# Altium project HV_BMS.PrjPcb (part 1 of 2)
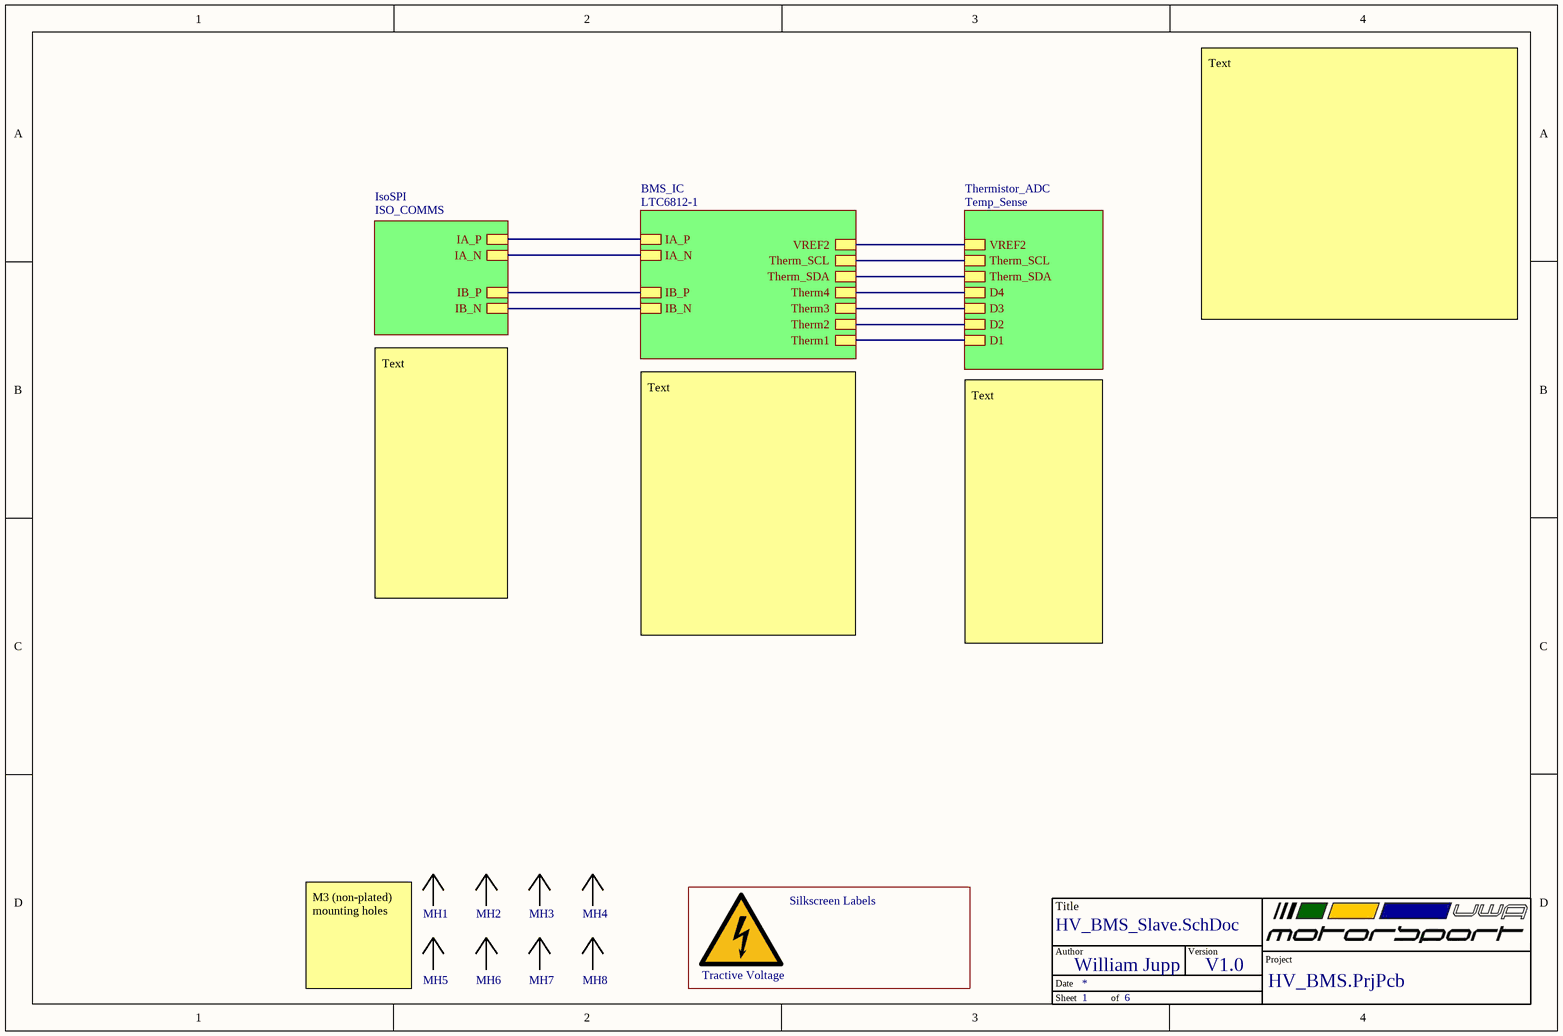
[diagram p0: HV_BMS_Slave.SchDoc]
Version: V1.0; ProAuthor: William Jupp
6 sheets, 304 parts. Net scope: hierarchical (ports join the sheet entries above them; power ports are global).
Board file: Slave_LHS.PcbDoc
Sheets:
  HV_BMS_Slave.SchDoc
    BMS_IC = LTC6812-1.SchDoc
      BC1 = Balance_Circuit.SchDoc
      BC2 = Balance_Circuit.SchDoc
      BC3 = Balance_Circuit.SchDoc
      BC4 = Balance_Circuit.SchDoc
      BC5 = Balance_Circuit.SchDoc
      BC6 = Balance_Circuit.SchDoc
      BC7 = Balance_Circuit.SchDoc
      BC8 = Balance_Circuit.SchDoc
      BC9 = Balance_Circuit.SchDoc
      BC10 = Balance_Circuit.SchDoc
      BC11 = Balance_Circuit.SchDoc
      BC12 = Balance_Circuit.SchDoc
      BC13 = Balance_Circuit.SchDoc
      BC14 = Balance_Circuit.SchDoc
    IsoSPI = ISO_COMMS.SchDoc
    Thermistor_ADC = Temp_Sense.SchDoc
      AFE1 = AFE.SchDoc
      AFE2 = AFE.SchDoc
      AFE3 = AFE.SchDoc
      AFE4 = AFE.SchDoc
      AFE5 = AFE.SchDoc
      AFE6 = AFE.SchDoc
      AFE7 = AFE.SchDoc
      AFE8 = AFE.SchDoc
      AFE9 = AFE.SchDoc
      AFE10 = AFE.SchDoc
      AFE11 = AFE.SchDoc
      AFE12 = AFE.SchDoc
      AFE13 = AFE.SchDoc
      AFE14 = AFE.SchDoc
      AFE15 = AFE.SchDoc
      AFE16 = AFE.SchDoc
      AFE17 = AFE.SchDoc
      AFE18 = AFE.SchDoc
      AFE19 = AFE.SchDoc
      AFE20 = AFE.SchDoc
      AFE21 = AFE.SchDoc
      AFE22 = AFE.SchDoc
      AFE23 = AFE.SchDoc
      AFE24 = AFE.SchDoc
      AFE25 = AFE.SchDoc
      AFE26 = AFE.SchDoc
      AFE27 = AFE.SchDoc
      AFE28 = AFE.SchDoc

## Sheet HV_BMS_Slave.SchDoc: HV_BMS_Slave1
size A4; Revision: V1.0; SheetNumber: 1; SheetTotal: 6

### Parts
(Parts that share a designator on the sheet are numbered #1, #2 ... from top to bottom, then left to right.)
1  UWAM Logo  [UWAM Logo]  (value not drawn)
*#1  TitleBlock  (value not drawn)  (graphical)
?  Tractive voltage symbol  [Tractive voltage]  (value not drawn)  (graphical)
MH1  M3 Mounting Holes  [M3 MH]  (value not drawn)  (mechanical)
MH2  M3 Mounting Holes  [M3 MH]  (value not drawn)  (mechanical)
MH3  M3 Mounting Holes  [M3 MH]  (value not drawn)  (mechanical)
MH4  M3 Mounting Holes  [M3 MH]  (value not drawn)  (mechanical)
MH5  M3 Mounting Holes  [M3 MH]  (value not drawn)  (mechanical)
MH6  M3 Mounting Holes  [M3 MH]  (value not drawn)  (mechanical)
MH7  M3 Mounting Holes  [M3 MH]  (value not drawn)  (mechanical)
MH8  M3 Mounting Holes  [M3 MH]  (value not drawn)  (mechanical)

### Blocks framed on the sheet
Silkscreen Labels: 1 ?

### Sub-sheets
BMS_IC = LTC6812-1: IA_N, IA_P, IB_N, IB_P, Therm2, Therm3, Therm4, Therm1, Therm_SCL, Therm_SDA, VREF2
IsoSPI = ISO_COMMS: IA_N, IA_P, IB_N, IB_P
Thermistor_ADC = Temp_Sense: Therm_SDA, Therm_SCL, D4, D3, D1, D2, VREF2

### Nets
IA_N: sheet BMS_IC/IA_N, sheet IsoSPI/IA_N
IA_P: sheet BMS_IC/IA_P, sheet IsoSPI/IA_P
IB_N: sheet BMS_IC/IB_N, sheet IsoSPI/IB_N
IB_P: sheet BMS_IC/IB_P, sheet IsoSPI/IB_P
SCL: sheet BMS_IC/Therm_SCL, sheet Thermistor_ADC/Therm_SCL
SDA: sheet BMS_IC/Therm_SDA, sheet Thermistor_ADC/Therm_SDA
VREF2: sheet BMS_IC/VREF2, sheet Thermistor_ADC/VREF2
NetU1_8: sheet BMS_IC/Therm4, sheet Thermistor_ADC/D4
NetU2_8: sheet BMS_IC/Therm3, sheet Thermistor_ADC/D3
NetU3_8: sheet BMS_IC/Therm2, sheet Thermistor_ADC/D2
NetU4_8: sheet BMS_IC/Therm1, sheet Thermistor_ADC/D1

### Notes on the sheet
- Text
- M3 (non-plated) mounting holes
- (in symbol TitleBlock) Title; Author; Version; Project; Date; Sheet; of
- (in symbol Tractive voltage symbol) Tractive Voltage

## Sheet LTC6812-1.SchDoc
size A4; SheetNumber: 4; SheetTotal: 6
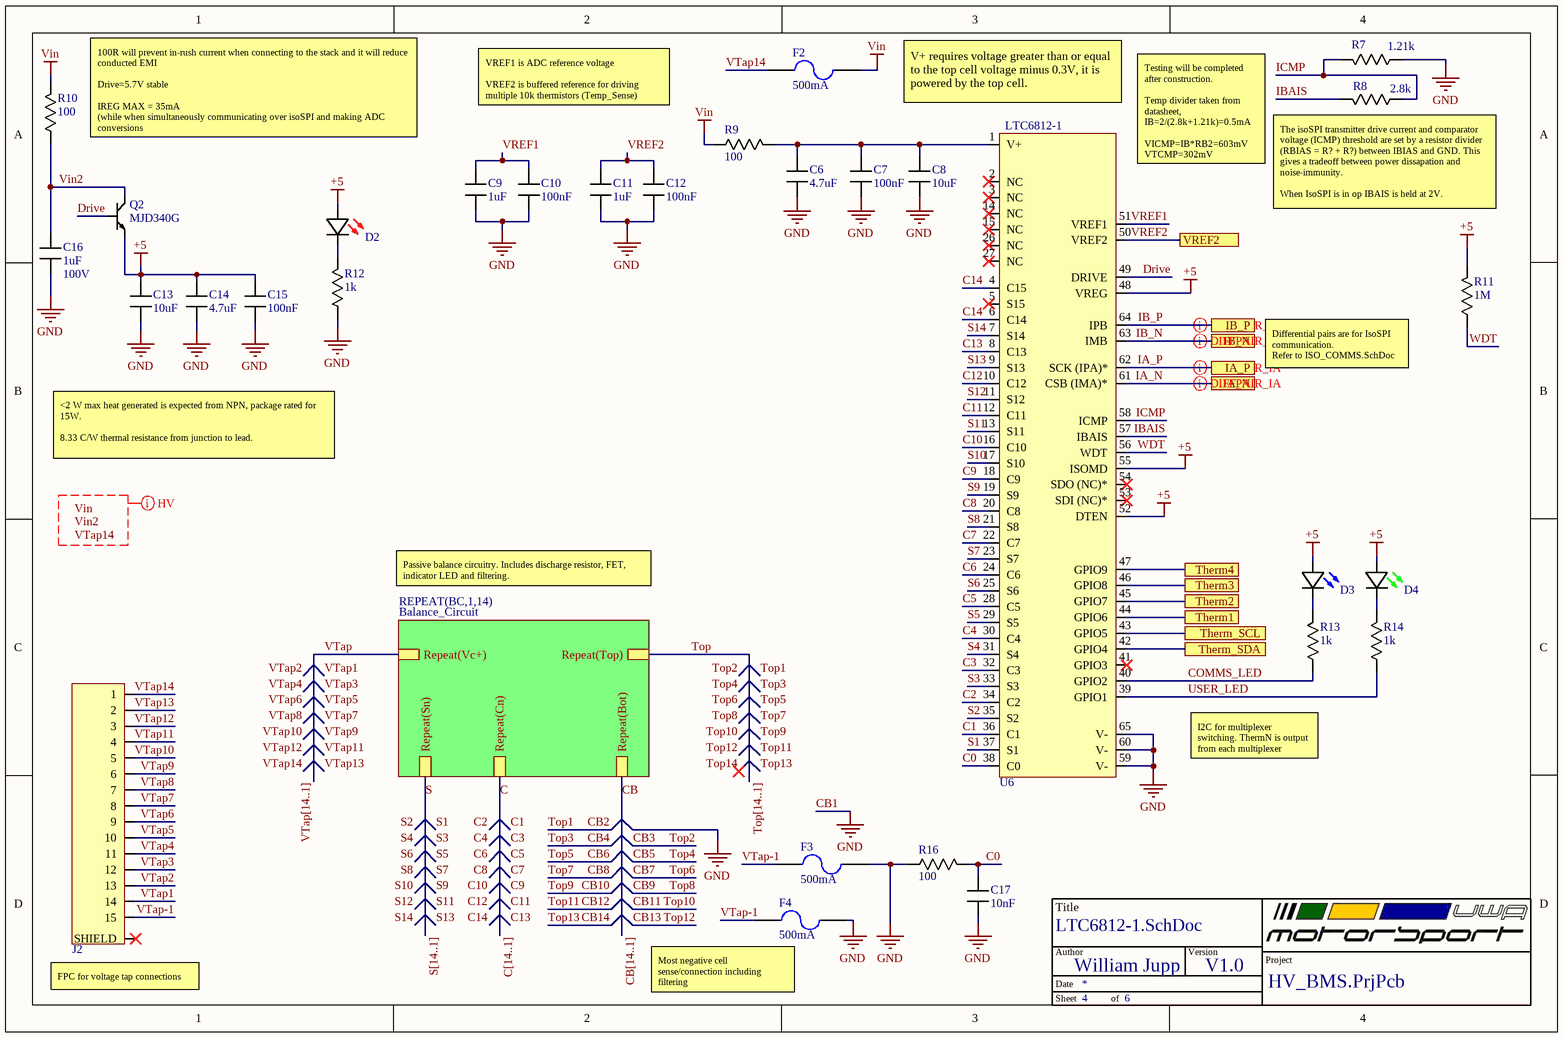
[diagram p1: LTC6812-1.SchDoc]

### Parts
(Parts that share a designator on the sheet are numbered #1, #2 ... from top to bottom, then left to right.)
*#2  TitleBlock  (value not drawn)  (graphical)
C6  value 4.7uF  [C_0603]  (hidden comment: C)
C7  value 100nF  [C_0603]  (hidden comment: C)
C8  value 10uF  [C_0603]  (hidden comment: C)
C9  value 1uF  [C_0603]  (hidden comment: C)
C10  value 100nF  [C_0603]  (hidden comment: C)
C11  value 1uF  [C_0603]  (hidden comment: C)
C12  value 100nF  [C_0603]  (hidden comment: C)
C13  value 10uF  [C_0603]  (hidden comment: C)
C14  value 4.7uF  [C_0603]  (hidden comment: C)
C15  value 100nF  [C_0603]  (hidden comment: C)
C16  value 1uF  Voltage: 100V  [C_0603]  (hidden comment: C)
C17  value 10nF  [C_0603]  (hidden comment: C)
D2  150060SS55040  [LED (0603)]  (value not drawn)
D3  150060BS55040  [LED (0603)]  (value not drawn)
D4  150060GS55040  [LED (0603)]  (value not drawn)
F2  Current Rating: 500mA  [0466.500NR]  (hidden comment: 0466.500NR)
F3  Current Rating: 500mA  [0466.500NR]  (hidden comment: 0466.500NR)
F4  Current Rating: 500mA  [0466.500NR]  (hidden comment: 0466.500NR)
J2  1-84953-5  [1-84953-5]  (value not drawn)
Q2  MJD340G  [TO-252-3]
R7  value 1.21k  [R-0603]  (hidden comment: Resistor)
R8  value 2.8k  [R-0603]  (hidden comment: RB1)
R9  value 100  [R_2010]  (hidden comment: ERJ-12ZYJ101U)
R10  value 100  [R_2010]  (hidden comment: ERJ-12ZYJ101U)
R11  value 1M  [R-0603]  (hidden comment: Resistor)
R12  value 1k  [R-0603]  (hidden comment: Resistor)
R13  value 1k  [R-0603]  (hidden comment: Resistor)
R14  value 1k  [R-0603]  (hidden comment: Resistor)
R16  value 100  [R-0603]  (hidden comment: Resistor)
U6  LTC6812-1  [64-eLQFP]

### Sub-sheets
REPEAT(BC,1,14) = Balance_Circuit: Repeat(Cn), Repeat(Sn), Repeat(Vc+), Repeat(Bot), Repeat(Top)

### Ports
IA_N, IA_P, IB_N, IB_P, Therm1, Therm2, Therm3, Therm4, Therm_SCL, Therm_SDA, VREF2

### Nets
+5: C13.2 C14.2 C15.2 D2.2(A) D3.2(A) D4.2(A) Q2.3(Emitter) R11.1 U6.48(VREG) U6.52(DTEN) U6.55(ISOMD)
CB1: C6.1 C7.1 C8.1 C9.1 C10.1 C11.1 C12.1 C13.1 C14.1 C15.1 C16.1 C17.1 F3.2 F4.2 R7.1 R12.1 R16.1 U6.59(V-) U6.60(V-) U6.65(V-)  [also labelled GND]
Vin: F2.2 R9.1 R10.2
C: sheet REPEAT(BC,1,14)/Repeat(Cn)
C0: C17.2 R16.2 U6.38(C0)
C1: U6.36(C1)
C2: U6.34(C2)
C3: U6.32(C3)
C4: U6.30(C4)
C5: U6.28(C5)
C6: U6.24(C6)
C7: U6.22(C7)
C8: U6.20(C8)
C9: U6.18(C9)
C10: U6.16(C10)
C11: U6.12(C11)
C12: U6.10(C12)
C13: U6.8(C13)
C14: U6.4(C15) U6.6(C14)
CB: sheet REPEAT(BC,1,14)/Repeat(Bot)
COMMS_LED: R13.1 U6.40(GPIO2)
Drive: Q2.1(Base) U6.49(DRIVE)
IA_N: U6.61(CSB_(IMA)*) ; port IA_N
IA_P: U6.62(SCK_(IPA)*) ; port IA_P
IB_N: U6.63(IMB) ; port IB_N
IB_P: U6.64(IPB) ; port IB_P
IBAIS: R8.2 U6.57(IBAIS)
ICMP: R7.2 R8.1 U6.58(ICMP)
S: sheet REPEAT(BC,1,14)/Repeat(Sn)
S1: U6.37(S1)
S2: U6.35(S2)
S3: U6.33(S3)
S4: U6.31(S4)
S5: U6.29(S5)
S6: U6.25(S6)
S7: U6.23(S7)
S8: U6.21(S8)
S9: U6.19(S9)
S10: U6.17(S10)
S11: U6.13(S11)
S12: U6.11(S12)
S13: U6.9(S13)
S14: U6.7(S14)
SCL: U6.43(GPIO5) ; port Therm_SCL
SDA: U6.42(GPIO4) ; port Therm_SDA
Top: sheet REPEAT(BC,1,14)/Repeat(Top)
USER_LED: R14.1 U6.39(GPIO1)
Vin2: C16.2 Q2.2(Collector) R10.1
VREF1: C9.2 C10.2 U6.51(VREF1)
VREF2: C11.2 C12.2 U6.50(VREF2) ; port VREF2
VTap: sheet REPEAT(BC,1,14)/Repeat(Vc+)
VTap1: J2.14
VTap2: J2.13
VTap3: J2.12
VTap4: J2.11
VTap5: J2.10
VTap6: J2.9
VTap7: J2.8
VTap8: J2.7
VTap9: J2.6
VTap10: J2.5
VTap11: J2.4
VTap12: J2.3
VTap13: J2.2
VTap14: F2.1 J2.1
VTap-1: F3.1 F4.1 J2.15
WDT: R11.2 U6.56(WDT)
NetC6_2: C6.2 C7.2 C8.2 R9.2 U6.1(V+)
NetD2_1: D2.1(K) R12.2
NetD3_1: D3.1(K) R13.2
NetD4_1: D4.1(K) R14.2
NetU1_8: U6.47(GPIO9) ; port Therm4
NetU2_8: U6.46(GPIO8) ; port Therm3
NetU3_8: U6.45(GPIO7) ; port Therm2
NetU4_8: U6.44(GPIO6) ; port Therm1

Not connected (* = marked no-connect by the designer): J2 S(SHIELD)*; U6 2(NC)* 3(NC)* 5(S15)* 14(NC)* 15(NC)* 26(NC)* 27(NC)* 41(GPIO3)* 53(SDI_(NC)*)* 54(SDO_(NC)*)*

### Buses and harness runs
bus C[14..1]
bus CB[14..1]
bus S[14..1]
bus Top[14..1]
bus VTap[14..1]

### Layout directives
differential pair; differential pair class IB: IB_N, IB_P
differential pair; differential pair class IA: IA_N, IA_P
net class HVNetClass: Vin, Vin2, VTap14

### Notes on the sheet
- VREF1 is ADC reference voltage
  VREF2 is buffered reference for driving multiple 10k thermistors (Temp_Sense)
- V+ requires voltage greater than or equal to the top cell voltage minus 0.3V, it is powered by the top cell.
- 100R will prevent in-rush current when connecting to the stack and it will reduce conducted EMI
  Drive=5.7V stable
  IREG MAX = 35mA
  (while when simultaneously communicating over isoSPI and making ADC conversions
- (near U6) Testing will be completed after construction.
  Temp divider taken from datasheet,
  IB=2/(2.8k+1.21k)=0.5mA
  VICMP=IB*RB2=603mV
  VTCMP=302mV
- (near R8) The isoSPI transmitter drive current and comparator
  voltage (ICMP) threshold are set by a resistor divider (RBIAS = R? + R?) between IBIAS and GND. This gives a tradeoff between power dissapation and noise-immunity.
  When IsoSPI is in op IBAIS is held at 2V.
  IP and IM current = 20*IB
- Differential pairs are for IsoSPI communication.
  Refer to ISO_COMMS.SchDoc
- <2 W max heat generated is expected from NPN, package rated for 15W.
  8.33 C/W thermal resistance from junction to lead.
- Passive balance circuitry. Includes discharge resistor, FET, indicator LED and filtering.
- I2C for multiplexer switching. ThermN is output from each multiplexer
- (near J2) FPC for voltage tap connections
- (near F4) Most negative cell sense/connection including filtering
- Labels drawn without touching a wire or pin: C1, C2, C3, C4, C5, C6, C7, C8, C9, C10, C11, C12, C13, C14, S1, S2, S3, S4, S5, S6, S7, S8, S9, S10, S11, S12, S13, S14, Top1, Top2, Top3, Top4, Top5, Top6, Top7, Top8, Top9, Top10, Top11, Top12, Top13, Top14, Vin, Vin2, VTap1, VTap2, VTap3, VTap4, VTap5, VTap6, VTap7, VTap8, VTap9, VTap10, VTap11, VTap12, VTap13, VTap14
- (in symbol TitleBlock) Title; Author; Version; Project; Date; Sheet; of

### Library data of the parts
C6-C8 C13-C17 = Capacitor: ComponentLink1Description: New link; ComponentLink1URL: *
C9-C12 = Capacitor: Bypass caps; ComponentLink1Description: New link; ComponentLink1URL: *
D2 = 150060SS55040: LED RED DIFFUSED 0603 SMD; Manufacturer: Wurth Electronics; Lens Style: Flat; Luminous Intensity: 70mcd; Forward Voltage: 2V; Test Current: 20mA; Viewing Angle: 140°; Dominant Wavelength: 630nm; Lens Size: 0.8mm; Supplier 1: Mouser; Manufacturer Part Number: 150060SS55040; RoHS: No; Category: LEDs; Stock 1: 17006; Pricing 1: 1=0.18000, 10=0.16800, 50=0.16800, 100=0.15200, 1000=0.12100, 10000=0.10600 (USD); Mount: Surface Mount; Case/Package: 0603; Color: Red; Case Code (Imperial): 0603; Case Code (Metric): 1608; Packaging: Tape and Reel; Lens Transparency: Diffused; Length: 1.6mm; Width: 0.8mm; Height: 0.5mm; RoHS Compliant: No; Supplier Part Number 1: 710-150060SS55040
D3 = 150060BS55040: LED BLUE DIFFUSED 0603 SMD; Manufacturer: Wurth Electronics; Lens Style: Flat; Luminous Intensity: 80mcd; Forward Voltage: 3.2V; Test Current: 20mA; Viewing Angle: 140°; Dominant Wavelength: 470nm; Lens Size: 0.8mm; Supplier 1: Mouser; Manufacturer Part Number: 150060BS55040; RoHS: No; Pricing 1: 1=0.18000, 10=0.16800, 50=0.16800, 100=0.15200, 1000=0.12100, 10000=0.10600 (USD); Mount: Surface Mount; Case/Package: 0603; Color: Blue; Packaging: Tape and Reel; Lens Transparency: Diffused; Length: 1.6mm; Width: 0.8mm; Height: 0.5mm; RoHS Compliant: No; ComponentLink1URL: http://www.farnell.com/datasheets/2621640.pdf?src-supplier=Farnell; ComponentLink1Description: http://www.farnell.com/datasheets/2621640.pdf?src-supplier=Farnell; ComponentLink2URL: https://www.we-online.de/web/en/index.php/download/media/07_electronic_components/download_center_1/application_notes_berichte/ano002_leds___the_future_of_horticultural_lighting/ANO002b_EN_LEDs_The_Future_of_Horticultural_Lighting.pdf?src-supplier=Digi-Key; ComponentLink2Description: https://www.we-online.de/web/en/index.php/download/media/07_electronic_components/download_center_1/application_notes_berichte/ano002_leds___the_future_of_horticultural_lighting/ANO002b_EN_LEDs_The_Future_of_Horticultural_Lighting.pdf?src-supplier=Digi-Key; ComponentLink3URL: https://katalog.we-online.de/pbs/datasheet/150060BS55040.pdf?src-supplier=Digi-Key; ComponentLink3Description: https://katalog.we-online.de/pbs/datasheet/150060BS55040.pdf?src-supplier=Digi-Key; ComponentLink4URL: http://www.farnell.com/datasheets/2621640.pdf?src-supplier=Newark; ComponentLink4Description: http://www.farnell.com/datasheets/2621640.pdf?src-supplier=Newark; Supplier Part Number 1: 710-150060BS55040
D4 = 150060GS55040: LED GREEN DIFFUSED 0603 SMD; Manufacturer: Wurth Electronics; Lens Style: Flat; Luminous Intensity: 430mcd; Forward Voltage: 3.2V; Test Current: 20mA; Viewing Angle: 140°; Dominant Wavelength: 525nm; Lens Size: 0.8mm; Supplier 1: Mouser; Manufacturer Part Number: 150060GS55040; RoHS: No; Category: LEDs; Stock 1: 3998; Pricing 1: 1=0.23000, 10=0.21000, 50=0.21000, 100=0.19000, 1000=0.15200, 10000=0.13200 (USD); Mount: Surface Mount; Case/Package: 0603; Color: Green; Case Code (Imperial): 0603; Case Code (Metric): 1608; Packaging: Cut Tape; Lens Transparency: Diffused; Length: 1.6mm; Width: 0.8mm; Height: 0.5mm; RoHS Compliant: No; ComponentLink1URL: http://www.farnell.com/datasheets/2621642.pdf?src-supplier=Farnell; ComponentLink1Description: http://www.farnell.com/datasheets/2621642.pdf?src-supplier=Farnell; ComponentLink2URL: http://katalog.we-online.de/pbs/datasheet/150060GS55040.pdf?src-supplier=Digi-Key; ComponentLink2Description: http://katalog.we-online.de/pbs/datasheet/150060GS55040.pdf?src-supplier=Digi-Key; ComponentLink3URL: https://www.we-online.de/web/en/index.php/download/media/07_electronic_components/download_center_1/application_notes_berichte/ano002_leds___the_future_of_horticultural_lighting/ANO002b_EN_LEDs_The_Future_of_Horticultural_Lighting.pdf?src-supplier=Digi-Key; ComponentLink3Description: https://www.we-online.de/web/en/index.php/download/media/07_electronic_components/download_center_1/application_notes_berichte/ano002_leds___the_future_of_horticultural_lighting/ANO002b_EN_LEDs_The_Future_of_Horticultural_Lighting.pdf?src-supplier=Digi-Key; ComponentLink4URL: https://katalog.we-online.de/pbs/datasheet/150060GS55040.pdf?src-supplier=Digi-Key; ComponentLink4Description: https://katalog.we-online.de/pbs/datasheet/150060GS55040.pdf?src-supplier=Digi-Key; ComponentLink5URL: http://www.farnell.com/datasheets/2621642.pdf?src-supplier=Newark; ComponentLink5Description: http://www.farnell.com/datasheets/2621642.pdf?src-supplier=Newark; Supplier Part Number 1: 710-150060GS55040
F2-F4 = Fuse 2: LITTELFUSE - 0466.500NR - Fuse, Surface Mount, 500 mA, 466 Series, 63 VAC, 63 VDC, Very Fast Acting, 1206; Body Material: Thermoplastic; Voltage Rating (AC): 63V; Resistance: 350mR; DC Cold Resistance: 248mR; Fuse Type: Board Mount (Cartridge Style Excluded); Approvals: UL,CSA; Published: 8-Jun-2000; LatestRevisionDate: 17-Jul-2002; LatestRevisionNote: Re-released for DXP Platform.; PackageReference: PIN-W2/E2.8; Publisher: Altium Limited; PackageDescription: Thru-Hole; 2 Leads; Supplier 1: Mouser; Supplier Part Number 1: 576-0466.500NR; Manufacturer: Littelfuse; Manufacturer Part Number: 0466.500NR; RoHS: Yes; Category: Fuses; Stock 1: 36497; Pricing 1: 1=0.77000, 10=0.59200, 50=0.59200, 100=0.48900, 1000=0.41600, 10000=0.39000 (USD); Mount: Surface Mount; Case/Package: 1206; Number of Pins: 2; Case Code (Metric): 3216; Case Code (Imperial): 1206; Housing Material: Ceramic; Terminal Material: Copper; Min Operating Temperature: -55°C; Max Operating Temperature: 90°C; Packaging: Tape and Reel; Package Quantity: 5000; Voltage Rating (DC): 63V; Series: 466; Voltage Rating: 63V; Termination: SMD/SMT; Fuse Current: 500mA; Working Voltage: 63V; Length: 3.18mm; Width: 0.06inch; Height: 0.023inch; Depth: 1.52mm; Radiation Hardening: No; RoHS Compliant: Yes; REACH SVHC: Unknown; Lead Free: Lead Free; ComponentLink1URL: https://datasheet.ciiva.com/17081/0466-500nr-17081083.pdf?src-supplier=Allied+Electronics; ComponentLink1Description: https://datasheet.ciiva.com/17081/0466-500nr-17081083.pdf?src-supplier=Allied+Electronics; ComponentLink2URL: https://datasheet.ciiva.com/16327/littelfuse-fuse-466-16327478.pdf?src-supplier=Future+Electronics; ComponentLink2Description: https://datasheet.ciiva.com/16327/littelfuse-fuse-466-16327478.pdf?src-supplier=Future+Electronics; ComponentLink3URL: https://datasheet.ciiva.com/299/466seriesdrawing-299207.pdf?src-supplier=Digi-Key; ComponentLink3Description: https://datasheet.ciiva.com/299/466seriesdrawing-299207.pdf?src-supplier=Digi-Key; ComponentLink4URL: https://datasheet.ciiva.com/299/466seriesdrawing-299208.pdf?src-supplier=Digi-Key; ComponentLink4Description: https://datasheet.ciiva.com/299/466seriesdrawing-299208.pdf?src-supplier=Digi-Key; ComponentLink5URL: https://datasheet.ciiva.com/299/466seriesdrawing-299209.pdf?src-supplier=Digi-Key; ComponentLink5Description: https://datasheet.ciiva.com/299/466seriesdrawing-299209.pdf?src-supplier=Digi-Key; ComponentLink6URL: https://datasheet.ciiva.com/14102/ei466-dat-e-14102891.pdf?src-supplier=Distrelec; ComponentLink6Description: https://datasheet.ciiva.com/14102/ei466-dat-e-14102891.pdf?src-supplier=Distrelec; ComponentLink7URL: https://datasheet.ciiva.com/15186/getdatasheetpartid-57351-15186924.pdf?src-supplier=Verical; ComponentLink7Description: https://datasheet.ciiva.com/15186/getdatasheetpartid-57351-15186924.pdf?src-supplier=Verical
J2 = 1-84953-5: Conn FPC Connector SKT 15 POS 1mm Solder RA SMD T/R; Manufacturer: TE Connectivity; Number of Contacts: 15; Wire/Cable Type: Flat Flex; Gender: Receptacle; Current Rating: 1A; Voltage Rating: 200V; Shielding: Unshielded; Connector Type: Receptacle,Connector,Socket; Connector System: Flex-to-Board; Mating Alignment: Yes (With); PCB Mount Alignment: No (Without); PCB Mount Retention: With; Contact Location: Top; PCB Mounting Orientation: Right Angle; Pitch: 0.039inch; Plating Thickness: 2um; Supplier 1: Mouser; Manufacturer Part Number: 1-84953-5; RoHS: Yes; Category: FFC / FPC; Stock 1: 7302; Pricing 1: 1=1.07000, 10=0.87800, 50=0.87800, 100=0.76700, 500=0.65900, 1000=0.65900, 1200=0.58600, 2400=0.53000, 4800=0.51200, 9600=0.48600, 10000=0.48600, 24000=0.47500 (USD); Mount: Surface Mount; Housing Material: Polymer; Housing Color: Natural; Contact Plating: Tin,Bright; Contact Material: Bronze; Min Operating Temperature: -40°C; Max Operating Temperature: 85°C; Termination: SMD/SMT; Orientation: Right Angle; Number of Rows: 1; Number of Positions: 15; Packaging: Tape and Reel; Package Quantity: 1200; Sealable: No (Without); Shrouded: Yes (With); Contact Current Rating: 1A; Max Voltage Rating (AC): 200V; Length: 22.92mm; Width: 0.2575inch; Height: 2.56mm; Depth: 7.3mm; Radiation Hardening: No; ELV: Compliant; ComponentLink1URL: https://datasheet.ciiva.com/669/eng-cd-84953-a3-669110.pdf?src-supplier=Digi-Key; ComponentLink1Description: https://datasheet.ciiva.com/669/eng-cd-84953-a3-669110.pdf?src-supplier=Digi-Key; ComponentLink2URL: https://datasheet.ciiva.com/669/eng-cd-84953-a3-669111.pdf?src-supplier=Digi-Key; ComponentLink2Description: https://datasheet.ciiva.com/669/eng-cd-84953-a3-669111.pdf?src-supplier=Digi-Key; ComponentLink3URL: https://datasheet.ciiva.com/16660/eng-ds-1-1773440-6-0506-16660135.pdf?src-supplier=Avnet+Europe; ComponentLink3Description: https://datasheet.ciiva.com/16660/eng-ds-1-1773440-6-0506-16660135.pdf?src-supplier=Avnet+Europe; ComponentLink4URL: https://datasheet.ciiva.com/669/eng-cd-84953-a3-669112.pdf?src-supplier=Digi-Key; ComponentLink4Description: https://datasheet.ciiva.com/669/eng-cd-84953-a3-669112.pdf?src-supplier=Digi-Key; Supplier Part Number 1: 571-1-84953-5
Q2 = MJD340G: ON SEMICONDUCTOR   MJD340G   Bipolar (BJT) Single Transistor, General Purpose, NPN, 300 V, 15 W, 500 mA, 240; hFE Min: 30; Max Power Dissipation: 15W; Number of Elements: 1; Collector Base Voltage (VCBO): 300V; Emitter Base Voltage (VEBO): 3V; Collector Emitter Saturation Voltage: 1V; Max Collector Current: 500mA; Transition Frequency: 10MHz; Power Dissipation: 1.56W; Supplier 1: RSComponents; Manufacturer: ON Semiconductor; Manufacturer Part Number: MJD340G; RoHS: Yes; Category: BJTs; Stock 1: 1; Pricing 1: 15=0.60500 (USD); Case/Package: DPAK; Number of Pins: 3; Contact Plating: Tin,Matte; Min Operating Temperature: -65°C; Max Operating Temperature: 150°C; Package Quantity: 75; Packaging: Rail/Tube; Polarity: NPN; Collector Emitter Voltage (VCEO): 300V; Collector Emitter Breakdown Voltage: 300V; Element Configuration: Single; Max Frequency: 10MHz; Voltage Rating (DC): 300V; Current Rating: 500mA; Collector-emitter Voltage-Max: 300V; Series: -; Length: 0.264inch; Width: 0.245inch; Height: 0.094inch; Radiation Hardening: No; REACH SVHC: No SVHC; Lead Free: Lead Free; RoHS Compliant: Yes; ComponentLink1URL: https://datasheet.ciiva.com/4721/mjd340-d-112116-4721347.pdf?src-supplier=Mouser; ComponentLink1Description: https://datasheet.ciiva.com/4721/mjd340-d-112116-4721347.pdf?src-supplier=Mouser; ComponentLink2URL: https://datasheet.ciiva.com/15138/getdatasheetpartid-41077-15138708.pdf?src-supplier=Verical; ComponentLink2Description: https://datasheet.ciiva.com/15138/getdatasheetpartid-41077-15138708.pdf?src-supplier=Verical; ComponentLink3URL: https://datasheet.ciiva.com/18429/70100598-18429461.pdf?src-supplier=Allied+Electronics; ComponentLink3Description: https://datasheet.ciiva.com/18429/70100598-18429461.pdf?src-supplier=Allied+Electronics; ComponentLink4URL: https://datasheet.ciiva.com/977/mjd340-d-977159.pdf?src-supplier=Digi-Key; ComponentLink4Description: https://datasheet.ciiva.com/977/mjd340-d-977159.pdf?src-supplier=Digi-Key; ComponentLink5URL: https://datasheet.ciiva.com/11201/mjd340-d-11201899.pdf?src-supplier=Avnet; ComponentLink5Description: https://datasheet.ciiva.com/11201/mjd340-d-11201899.pdf?src-supplier=Avnet; ComponentLink6URL: https://datasheet.ciiva.com/7972/mjd340-d-7972285.pdf?src-supplier=Element14; ComponentLink6Description: https://datasheet.ciiva.com/7972/mjd340-d-7972285.pdf?src-supplier=Element14; ComponentLink7URL: https://datasheet.ciiva.com/16462/mjd340-d-16462206.pdf?src-supplier=Future+Electronics; ComponentLink7Description: https://datasheet.ciiva.com/16462/mjd340-d-16462206.pdf?src-supplier=Future+Electronics; Supplier Part Number 1: 7905343
R7 = Resistor: RB2
R8-R10 = Resistor
U6 = LTC6812-1: Multicell battery stack monitor that measures up to 15 series connected battery cells

## Sheet Balance_Circuit.SchDoc
size A4; SheetNumber: 5; SheetTotal: 6
Used 14 times, as channels BMS_IC/BC1, BMS_IC/BC2, BMS_IC/BC3, BMS_IC/BC4, BMS_IC/BC5, BMS_IC/BC6, BMS_IC/BC7, BMS_IC/BC8, BMS_IC/BC9, BMS_IC/BC10, BMS_IC/BC11, BMS_IC/BC12, BMS_IC/BC13, BMS_IC/BC14. Parts and nets are listed once, with the designators drawn on the sheet.
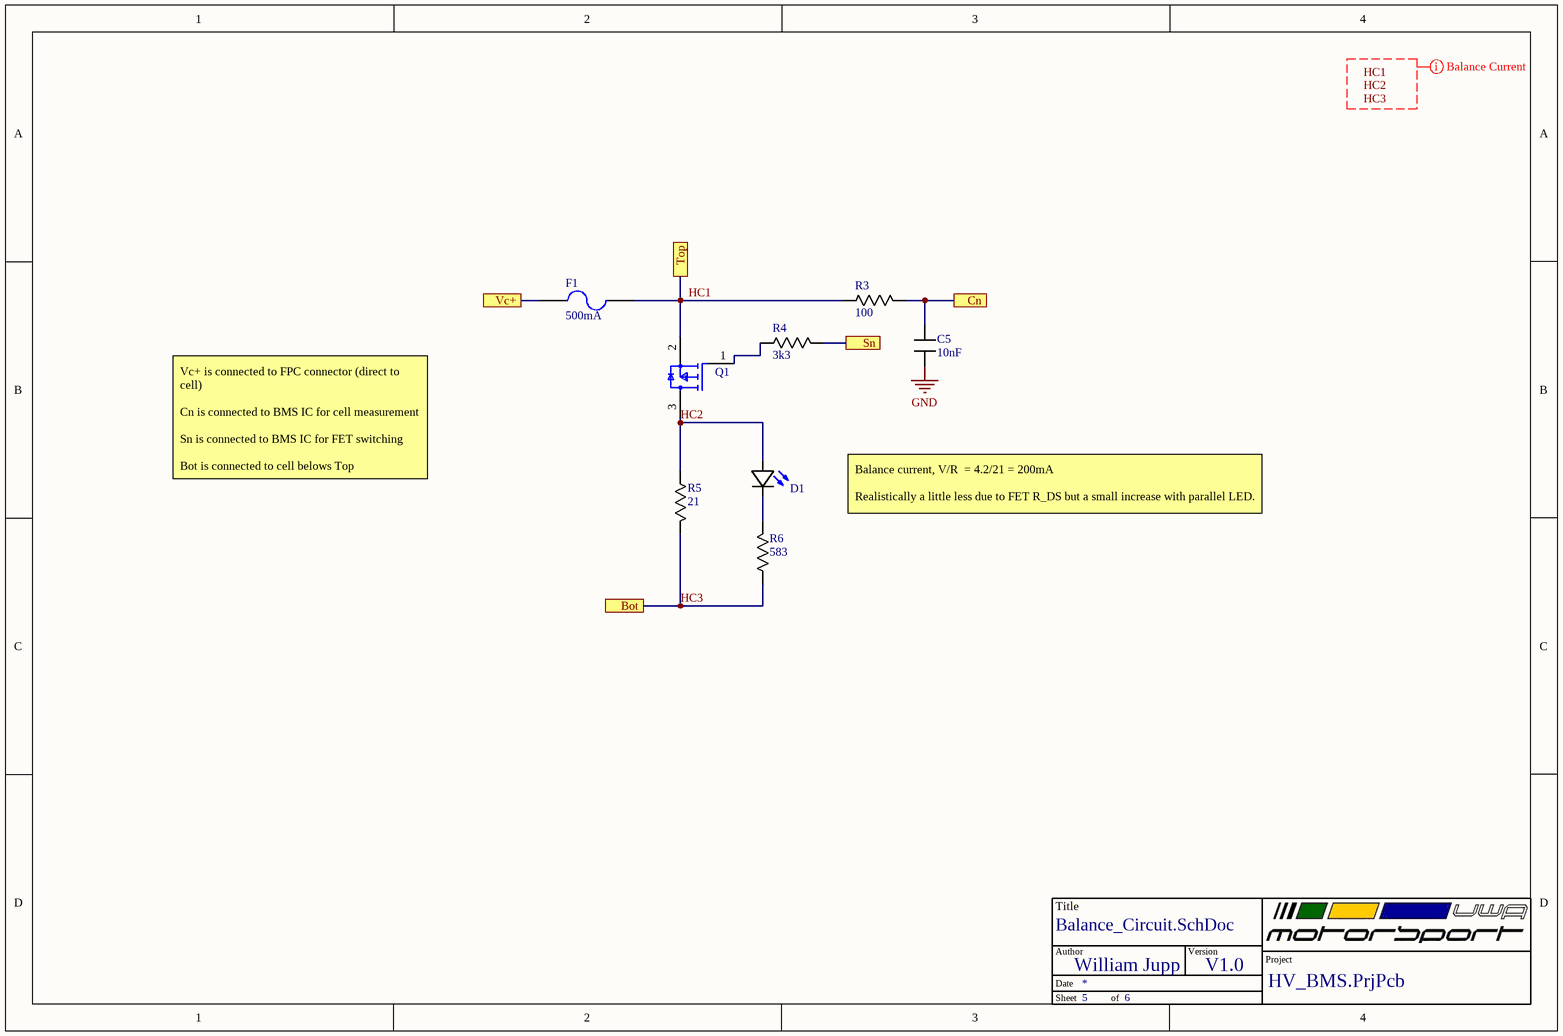
[diagram p2: Balance_Circuit.SchDoc]

### Parts
*  TitleBlock  (value not drawn)  (graphical)
C5  value 10nF  [C_0603]  (hidden comment: C)
D1  150060BS55040  [LED (0603)]  (value not drawn)
F1  Current Rating: 500mA  [0466.500NR]  (hidden comment: 0466.500NR)
Q1  NX2301P,215  [FP-SOT23-MFG]  (value not drawn)
R3  value 100  [R-0603]  (hidden comment: Resistor)
R4  value 3k3  [R-0603]  (hidden comment: Resistor)
R5  value 21  [R_2512]  (hidden comment: CRCW251221R0FKEGHP)
R6  value 583  [R-0603]  (hidden comment: RT0603DRE07583RL)

### Ports
Bot, Cn, Sn, Top, Vc+

### Nets
GND: C5.1
Cn: C5.2 R3.2 ; port Cn
HC1: F1.2 Q1.2(S) R3.1 ; port Top
HC2: D1.2(A) Q1.3(D) R5.1
HC3: R5.2 R6.1 ; port Bot
Sn: R4.2 ; port Sn
Vc+: F1.1 ; port Vc+
NetD1_1: D1.1(K) R6.2
NetQ1_1: Q1.1(G) R4.1

### Channels
BMS_IC/BC1: designators end in _BC1; ports Bot=CB1 Cn=C1 Sn=S1 Top=CB2 Vc+=VTap1
BMS_IC/BC2: designators end in _BC2; ports Bot=CB2 Cn=C2 Sn=S2 Top=CB3 Vc+=VTap2
BMS_IC/BC3: designators end in _BC3; ports Bot=CB3 Cn=C3 Sn=S3 Top=CB4 Vc+=VTap3
BMS_IC/BC4: designators end in _BC4; ports Bot=CB4 Cn=C4 Sn=S4 Top=CB5 Vc+=VTap4
BMS_IC/BC5: designators end in _BC5; ports Bot=CB5 Cn=C5 Sn=S5 Top=CB6 Vc+=VTap5
BMS_IC/BC6: designators end in _BC6; ports Bot=CB6 Cn=C6 Sn=S6 Top=CB7 Vc+=VTap6
BMS_IC/BC7: designators end in _BC7; ports Bot=CB7 Cn=C7 Sn=S7 Top=CB8 Vc+=VTap7
BMS_IC/BC8: designators end in _BC8; ports Bot=CB8 Cn=C8 Sn=S8 Top=CB9 Vc+=VTap8
BMS_IC/BC9: designators end in _BC9; ports Bot=CB9 Cn=C9 Sn=S9 Top=CB10 Vc+=VTap9
BMS_IC/BC10: designators end in _BC10; ports Bot=CB10 Cn=C10 Sn=S10 Top=CB11 Vc+=VTap10
BMS_IC/BC11: designators end in _BC11; ports Bot=CB11 Cn=C11 Sn=S11 Top=CB12 Vc+=VTap11
BMS_IC/BC12: designators end in _BC12; ports Bot=CB12 Cn=C12 Sn=S12 Top=CB13 Vc+=VTap12
BMS_IC/BC13: designators end in _BC13; ports Bot=CB13 Cn=C13 Sn=S13 Top=CB14 Vc+=VTap13
BMS_IC/BC14: designators end in _BC14; ports Bot=CB14 Cn=C14 Sn=S14 Top=HC1_BC14 Vc+=VTap14

### Layout directives
net class BalanceNetClass: HC1, HC2, HC3

### Notes on the sheet
- Vc+ is connected to FPC connector (direct to cell)
  Cn is connected to BMS IC for cell measurement
  Sn is connected to BMS IC for FET switching
  Bot is connected to cell belows Top
- Balance current, V/R  = 4.2/21 = 200mA
  Realistically a little less due to FET R_DS but a small increase with parallel LED.
- Labels drawn without touching a wire or pin: HC1, HC2, HC3
- (in symbol TitleBlock) Title; Author; Version; Project; Date; Sheet; of

### Library data of the parts
C5 = Capacitor: ComponentLink1Description: New link; ComponentLink1URL: *
D1 = 150060BS55040: as D3 on sheet LTC6812-1; Supplier 1: Mouser; Manufacturer Part Number: 150060BS55040; RoHS: No; Pricing 1: 1=0.18000, 10=0.16800, 50=0.16800, 100=0.15200, 1000=0.12100, 10000=0.10600 (USD); Mount: Surface Mount; Case/Package: 0603; Color: Blue; Packaging: Tape and Reel; Lens Transparency: Diffused; Length: 1.6mm; Width: 0.8mm; Height: 0.5mm; RoHS Compliant: No; ComponentLink1URL: http://www.farnell.com/datasheets/2621640.pdf?src-supplier=Farnell; ComponentLink1Description: http://www.farnell.com/datasheets/2621640.pdf?src-supplier=Farnell; ComponentLink2URL: https://www.we-online.de/web/en/index.php/download/media/07_electronic_components/download_center_1/application_notes_berichte/ano002_leds___the_future_of_horticultural_lighting/ANO002b_EN_LEDs_The_Future_of_Horticultural_Lighting.pdf?src-supplier=Digi-Key; ComponentLink2Description: https://www.we-online.de/web/en/index.php/download/media/07_electronic_components/download_center_1/application_notes_berichte/ano002_leds___the_future_of_horticultural_lighting/ANO002b_EN_LEDs_The_Future_of_Horticultural_Lighting.pdf?src-supplier=Digi-Key; ComponentLink3URL: https://katalog.we-online.de/pbs/datasheet/150060BS55040.pdf?src-supplier=Digi-Key; ComponentLink3Description: https://katalog.we-online.de/pbs/datasheet/150060BS55040.pdf?src-supplier=Digi-Key; ComponentLink4URL: http://www.farnell.com/datasheets/2621640.pdf?src-supplier=Newark; ComponentLink4Description: http://www.farnell.com/datasheets/2621640.pdf?src-supplier=Newark; Supplier Part Number 1: 710-150060BS55040
F1 = Fuse 2: as F2 on sheet LTC6812-1; Published: 8-Jun-2000; LatestRevisionDate: 17-Jul-2002; LatestRevisionNote: Re-released for DXP Platform.; PackageReference: PIN-W2/E2.8; Publisher: Altium Limited; PackageDescription: Thru-Hole; 2 Leads; Supplier 1: Mouser; Supplier Part Number 1: 576-0466.500NR; Manufacturer: Littelfuse; Manufacturer Part Number: 0466.500NR; RoHS: Yes; Category: Fuses; Stock 1: 36497; Pricing 1: 1=0.77000, 10=0.59200, 50=0.59200, 100=0.48900, 1000=0.41600, 10000=0.39000 (USD); Mount: Surface Mount; Case/Package: 1206; Number of Pins: 2; Case Code (Metric): 3216; Case Code (Imperial): 1206; Housing Material: Ceramic; Terminal Material: Copper; Min Operating Temperature: -55°C; Max Operating Temperature: 90°C; Packaging: Tape and Reel; Package Quantity: 5000; Voltage Rating (DC): 63V; Series: 466; Voltage Rating: 63V; Termination: SMD/SMT; Fuse Current: 500mA; Working Voltage: 63V; Length: 3.18mm; Width: 0.06inch; Height: 0.023inch; Depth: 1.52mm; Radiation Hardening: No; RoHS Compliant: Yes; REACH SVHC: Unknown; Lead Free: Lead Free; ComponentLink1URL: https://datasheet.ciiva.com/17081/0466-500nr-17081083.pdf?src-supplier=Allied+Electronics; ComponentLink1Description: https://datasheet.ciiva.com/17081/0466-500nr-17081083.pdf?src-supplier=Allied+Electronics; ComponentLink2URL: https://datasheet.ciiva.com/16327/littelfuse-fuse-466-16327478.pdf?src-supplier=Future+Electronics; ComponentLink2Description: https://datasheet.ciiva.com/16327/littelfuse-fuse-466-16327478.pdf?src-supplier=Future+Electronics; ComponentLink3URL: https://datasheet.ciiva.com/299/466seriesdrawing-299207.pdf?src-supplier=Digi-Key; ComponentLink3Description: https://datasheet.ciiva.com/299/466seriesdrawing-299207.pdf?src-supplier=Digi-Key; ComponentLink4URL: https://datasheet.ciiva.com/299/466seriesdrawing-299208.pdf?src-supplier=Digi-Key; ComponentLink4Description: https://datasheet.ciiva.com/299/466seriesdrawing-299208.pdf?src-supplier=Digi-Key; ComponentLink5URL: https://datasheet.ciiva.com/299/466seriesdrawing-299209.pdf?src-supplier=Digi-Key; ComponentLink5Description: https://datasheet.ciiva.com/299/466seriesdrawing-299209.pdf?src-supplier=Digi-Key; ComponentLink6URL: https://datasheet.ciiva.com/14102/ei466-dat-e-14102891.pdf?src-supplier=Distrelec; ComponentLink6Description: https://datasheet.ciiva.com/14102/ei466-dat-e-14102891.pdf?src-supplier=Distrelec; ComponentLink7URL: https://datasheet.ciiva.com/15186/getdatasheetpartid-57351-15186924.pdf?src-supplier=Verical; ComponentLink7Description: https://datasheet.ciiva.com/15186/getdatasheetpartid-57351-15186924.pdf?src-supplier=Verical
Q1 = CMP-14409-000018-1: MOSFET P-CH 20V 2A TO-236AB
R5 = Resistor: Balance Resistor; Supplier 1: Mouser; Supplier Part Number 1: 71-CRCW251221R0FKEGH
R6 = Resistor: Supplier 1: Mouser; Supplier Part Number 1: 603-RT0603DRE07583RL

## Sheet ISO_COMMS.SchDoc
size A4; SheetNumber: 6; SheetTotal: 6
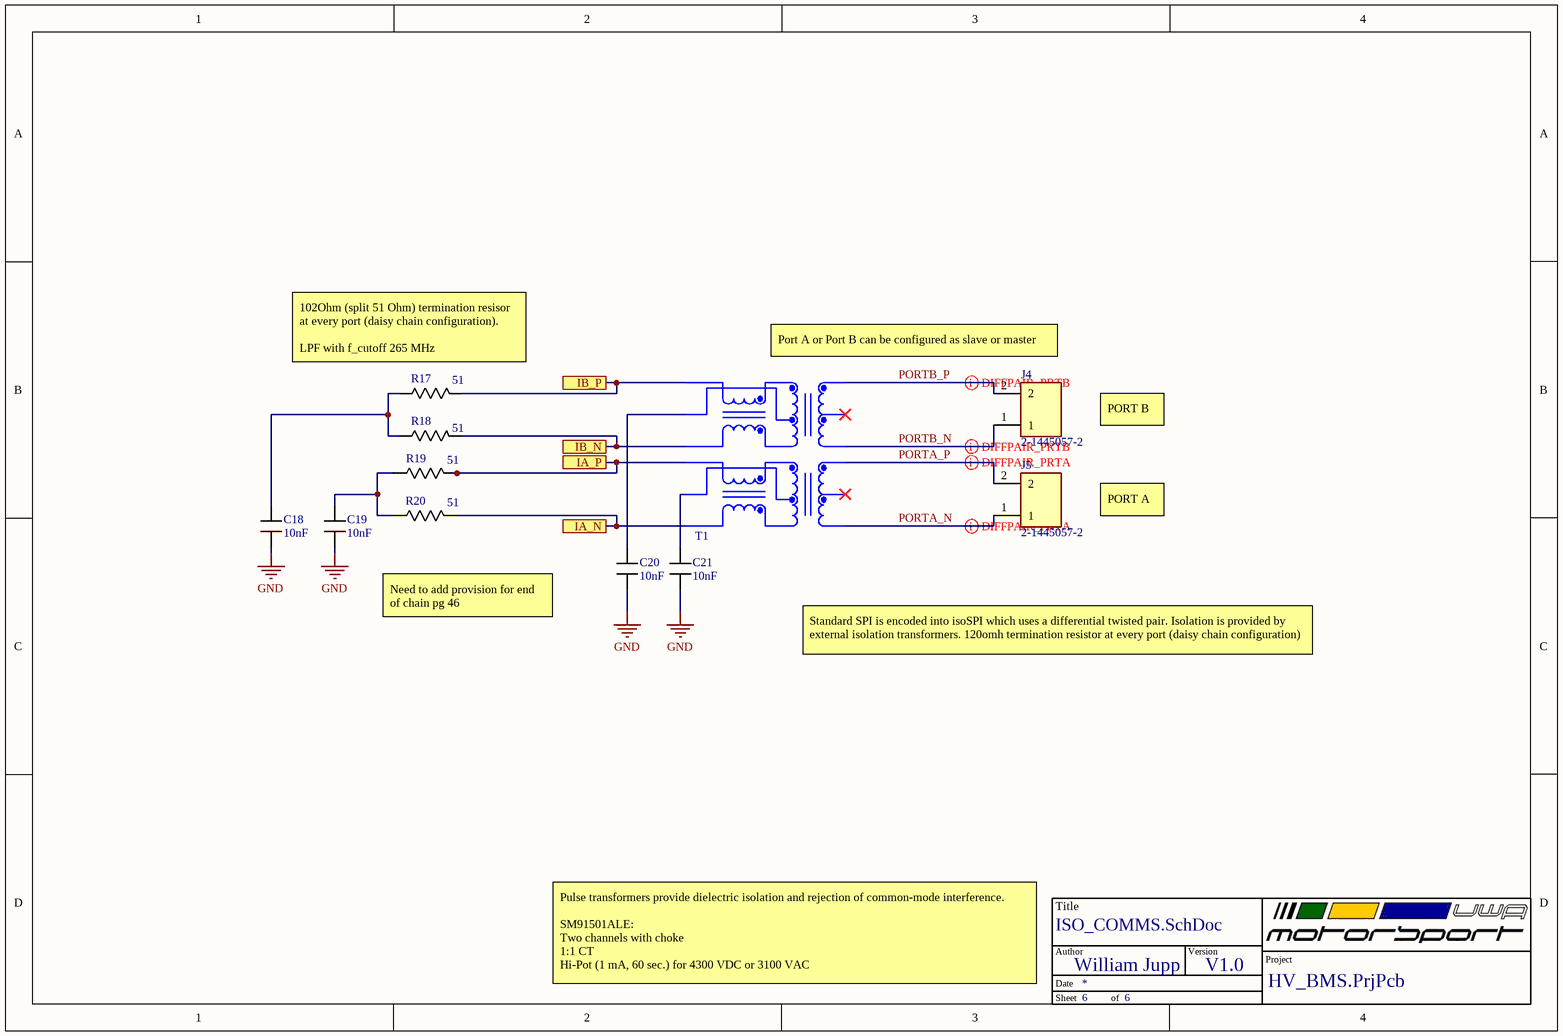
[diagram p3: ISO_COMMS.SchDoc]

### Parts
(Parts that share a designator on the sheet are numbered #1, #2 ... from top to bottom, then left to right.)
*#3  TitleBlock  (value not drawn)  (graphical)
C18  value 10nF  [C_0603]  (hidden comment: C)
C19  value 10nF  [C_0603]  (hidden comment: C)
C20  value 10nF  [C_0603]  (hidden comment: C)
C21  value 10nF  [C_0603]  (hidden comment: C)
J4  2-1445057-2  [TE_2-1445057-2]
J5  2-1445057-2  [TE_2-1445057-2]
R17  value 51  [R-0603]  (hidden comment: Resistor)
R18  value 51  [R-0603]  (hidden comment: Resistor)
R19  value 51  [R-0603]  (hidden comment: Resistor)
R20  value 51  [R-0603]  (hidden comment: Resistor)
T1  SM91501ALE  [SM91501ALE]  (value not drawn)

### Ports
IA_N, IA_P, IB_N, IB_P

### Nets
GND: C18.1 C19.1 C20.2 C21.1  [project net CB1]
IA_N: R20.1 T1.7 ; port IA_N
IA_P: R19.2 T1.9 ; port IA_P
IB_N: R18.1 T1.10 ; port IB_N
IB_P: R17.2 T1.12 ; port IB_P
PORTA_N: J5.1 T1.6
PORTA_P: J5.2 T1.4
PORTB_N: J4.1 T1.3
PORTB_P: J4.2 T1.1
NetC18_2: C18.2 R17.1 R18.2
NetC19_2: C19.2 R19.1 R20.2
NetC20_1: C20.1 T1.11
NetC21_2: C21.2 T1.8

Not connected (* = marked no-connect by the designer): T1 2* 5*

### Layout directives
differential pair; differential pair class PRTB: PORTB_N, PORTB_P
differential pair; differential pair class PRTA: PORTA_N, PORTA_P

### Notes on the sheet
- (near R17) 102Ohm (split 51 Ohm) termination resisor at every port (daisy chain configuration).
  LPF with f_cutoff 265 MHz
- Port A or Port B can be configured as slave or master
- PORT B
- PORT A
- Need to add provision for end of chain pg 46
- Standard SPI is encoded into isoSPI which uses a differential twisted pair. Isolation is provided by external isolation transformers. 120omh termination resistor at every port (daisy chain configuration)
- (near *#3) Pulse transformers provide dielectric isolation and rejection of common-mode interference.
  SM91501ALE:
  Two channels with choke
  1:1 CT
  Hi-Pot (1 mA, 60 sec.) for 4300 VDC or 3100 VAC
- (in symbol TitleBlock) Title; Author; Version; Project; Date; Sheet; of

### Library data of the parts
C18-C21 = Capacitor: ComponentLink1Description: New link; ComponentLink1URL: *
J4 = 2-1445057-2: CONN HEADER 3MM 2POS R/A TIN SMD--; MF: {'manufacturer': u'TE Connectivity'}; Package: None; MP: 2-1445057-2; Availability: Unavailable; Price: None; Value: *
J5 = 2-1445057-2: CONN HEADER 3MM 2POS R/A TIN SMD; MF: {'manufacturer': u'TE Connectivity'}; Package: None; MP: 2-1445057-2; Availability: Unavailable; Price: None; Value: *
T1 = SM91501ALE: BMS XFORMER 2-CH 1600V AECQ +125; Manufacturer: Bourns; Inductance: 150uH; Turns Ratio: 1:1; Supplier 1: Mouser; Manufacturer Part Number: SM91501ALE; RoHS: No; Stock 1: 566; Pricing 1: 1=5.20000, 10=4.21000, 50=3.14000, 100=3.05000, 1000=2.78000, 10000=2.78000 (USD); Mount: Surface Mount; Min Operating Temperature: -40°C; Max Operating Temperature: 125°C; Packaging: Cut Tape; ComponentLink1URL: https://www.bourns.com/docs/product-datasheets/sm91501al.pdf?src-supplier=Digi-Key; ComponentLink1Description: https://www.bourns.com/docs/product-datasheets/sm91501al.pdf?src-supplier=Digi-Key; Supplier Part Number 1: 652-SM91501ALE

## Sheet Temp_Sense.SchDoc
size A4; SheetNumber: 2; SheetTotal: 6
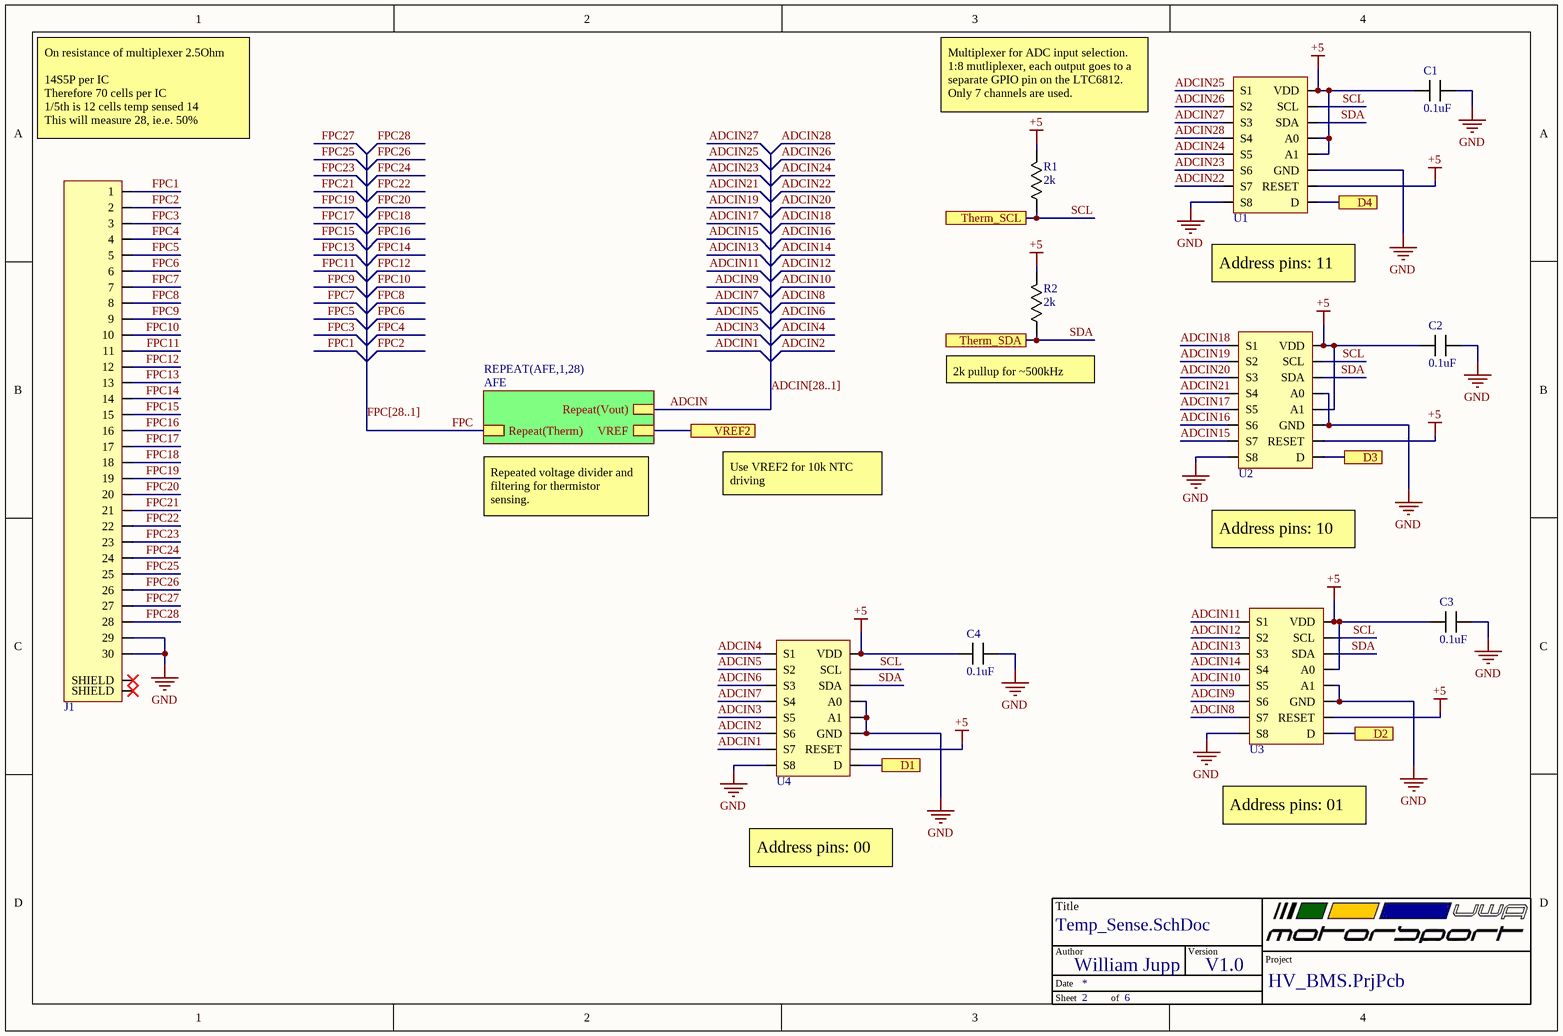
[diagram p4: Temp_Sense.SchDoc]

### Parts
(Parts that share a designator on the sheet are numbered #1, #2 ... from top to bottom, then left to right.)
*#4  TitleBlock  (value not drawn)  (graphical)
C1  value 0.1uF  [C_0603]  (hidden comment: C)
C2  value 0.1uF  [C_0603]  (hidden comment: C)
C3  value 0.1uF  [C_0603]  (hidden comment: C)
C4  value 0.1uF  [C_0603]  (hidden comment: C)
J1  3-84953-0  [3-84953-0]  (value not drawn)
R1  value 2k  [R-0603]  (hidden comment: Resistor)
R2  value 2k  [R-0603]  (hidden comment: Resistor)
U1  ADG728  [ADG728]  (value not drawn)
U2  ADG728  [ADG728]  (value not drawn)
U3  ADG728  [ADG728]  (value not drawn)
U4  ADG728  [ADG728]  (value not drawn)

### Sub-sheets
REPEAT(AFE,1,28) = AFE: Repeat(Vout), Repeat(Therm), VREF

### Ports
D1, D2, D3, D4, Therm_SCL, Therm_SDA, VREF2

### Nets
+5: C1.2 C2.2 C3.2 C4.2 R1.2 R2.2 U1.2(RESET) U1.13(VDD) U1.15(A1) U1.16(A0) U2.2(RESET) U2.13(VDD) U2.15(A1) U3.2(RESET) U3.13(VDD) U3.16(A0) U4.2(RESET) U4.13(VDD)
GND: C1.1 C2.1 C3.1 C4.1 J1.29 J1.30 U1.9(S8) U1.14(GND) U2.9(S8) U2.14(GND) U2.16(A0) U3.9(S8) U3.14(GND) U3.15(A1) U4.9(S8) U4.14(GND) U4.15(A1) U4.16(A0)  [project net CB1]
ADCIN: sheet REPEAT(AFE,1,28)/Repeat(Vout)
ADCIN1: U4.10(S7)
ADCIN2: U4.11(S6)
ADCIN3: U4.12(S5)
ADCIN4: U4.4(S1)
ADCIN5: U4.5(S2)
ADCIN6: U4.6(S3)
ADCIN7: U4.7(S4)
ADCIN8: U3.10(S7)
ADCIN9: U3.11(S6)
ADCIN10: U3.12(S5)
ADCIN11: U3.4(S1)
ADCIN12: U3.5(S2)
ADCIN13: U3.6(S3)
ADCIN14: U3.7(S4)
ADCIN15: U2.10(S7)
ADCIN16: U2.11(S6)
ADCIN17: U2.12(S5)
ADCIN18: U2.4(S1)
ADCIN19: U2.5(S2)
ADCIN20: U2.6(S3)
ADCIN21: U2.7(S4)
ADCIN22: U1.10(S7)
ADCIN23: U1.11(S6)
ADCIN24: U1.12(S5)
ADCIN25: U1.4(S1)
ADCIN26: U1.5(S2)
ADCIN27: U1.6(S3)
ADCIN28: U1.7(S4)
FPC: sheet REPEAT(AFE,1,28)/Repeat(Therm)
FPC1: J1.1
FPC2: J1.2
FPC3: J1.3
FPC4: J1.4
FPC5: J1.5
FPC6: J1.6
FPC7: J1.7
FPC8: J1.8
FPC9: J1.9
FPC10: J1.10
FPC11: J1.11
FPC12: J1.12
FPC13: J1.13
FPC14: J1.14
FPC15: J1.15
FPC16: J1.16
FPC17: J1.17
FPC18: J1.18
FPC19: J1.19
FPC20: J1.20
FPC21: J1.21
FPC22: J1.22
FPC23: J1.23
FPC24: J1.24
FPC25: J1.25
FPC26: J1.26
FPC27: J1.27
FPC28: J1.28
SCL: R1.1 U1.1(SCL) U2.1(SCL) U3.1(SCL) U4.1(SCL) ; port Therm_SCL
SDA: R2.1 U1.3(SDA) U2.3(SDA) U3.3(SDA) U4.3(SDA) ; port Therm_SDA
VREF2: port VREF2, sheet REPEAT(AFE,1,28)/VREF
NetU1_8: U1.8(D) ; port D4
NetU2_8: U2.8(D) ; port D3
NetU3_8: U3.8(D) ; port D2
NetU4_8: U4.8(D) ; port D1

Not connected (* = marked no-connect by the designer): J1 S1(SHIELD)* S2(SHIELD)*

### Buses and harness runs
bus ADCIN[28..1]
bus FPC[28..1]

### Notes on the sheet
- (near R1) Multiplexer for ADC input selection. 1:8 mutliplexer, each output goes to a separate GPIO pin on the LTC6812. Only 7 channels are used.
- (near J1) On resistance of multiplexer 2.5Ohm
  14S5P per IC
  Therefore 70 cells per IC
  1/5th is 12 cells temp sensed 14
  This will measure 28, ie.e. 50%
- Address pins: 11
- (near R2) 2k pullup for ~500kHz
- Repeated voltage divider and filtering for thermistor sensing.
- Use VREF2 for 10k NTC driving
- Address pins: 10
- (near U3) Address pins: 01
- Address pins: 00
- (in symbol TitleBlock) Title; Author; Version; Project; Date; Sheet; of

### Library data of the parts
C1-C4 = Capacitor: ComponentLink1Description: New link; ComponentLink1URL: *
J1 = 3-84953-0: CONN FPC TOP 30POS 1.00MM R/A; Manufacturer: TE Connectivity; Body Plating: Tin; Actuator Material: Nylon,Glass,Polyamide; Actuator Color: Black; Number of Contacts: 30; Current Rating: 1A; Voltage Rating: 200V; Contact Resistance: 10mR; Gender: Female; Shielding: Unshielded; Connector Type: Receptacle,Connector,Socket; Wire/Cable Type: Flat Flex; Connector System: Flex-to-Board; Mating Alignment: Yes (With); PCB Mount Alignment: No (Without); PCB Mount Retention: With; PCB Mounting Orientation: Right Angle; Insulation: Non-Insulated; Pitch: 0.039inch; Plating Thickness: 2um; Pin Diameter: 0.2mm; Supplier 1: Mouser; Manufacturer Part Number: 3-84953-0; RoHS: Yes; Category: FFC / FPC; Stock 1: 14380; Pricing 1: 1=1.65000, 10=1.41000, 50=1.41000, 100=1.22000, 500=1.07000, 1000=1.07000, 1200=0.91500, 2400=0.87100, 10000=0.87100 (USD); Mount: Surface Mount,Through Hole; Contact Plating: Tin,Bright; Contact Material: Bronze; Color: Natural; Material: Thermoplastic; Housing Color: Natural; Housing Material: Polymer; Min Operating Temperature: -40°C; Max Operating Temperature: 85°C; Number of Rows: 1; Termination: SMD/SMT; Orientation: Right Angle; Package Quantity: 1200; Packaging: Tape and Reel; Max Voltage Rating (AC): 200V; Number of Positions: 30; Contact Location: Top; Sealable: No (Without); Shrouded: Yes (With); Contact Current Rating: 1A; Series: -; Length: 37.92mm; Width: 0.2575inch; Height: 2.56mm; Lead Pitch: 1mm; Depth: 7.3mm; Radiation Hardening: No; REACH SVHC: No SVHC; ELV: Compliant; Flammability Rating: UL94 V-0; ComponentLink1URL: https://datasheet.ciiva.com/11745/0900766b806d28d6-11745122.pdf?src-supplier=RSComponents; ComponentLink1Description: https://datasheet.ciiva.com/11745/0900766b806d28d6-11745122.pdf?src-supplier=RSComponents; ComponentLink2URL: https://datasheet.ciiva.com/1437/eng-cd-84953-a3-1437863.pdf?src-supplier=Element14; ComponentLink2Description: https://datasheet.ciiva.com/1437/eng-cd-84953-a3-1437863.pdf?src-supplier=Element14; ComponentLink3URL: https://datasheet.ciiva.com/1437/eng-cd-84953-a3-1437862.pdf?src-supplier=Element14; ComponentLink3Description: https://datasheet.ciiva.com/1437/eng-cd-84953-a3-1437862.pdf?src-supplier=Element14; ComponentLink4URL: https://datasheet.ciiva.com/5750/586796-5750949.pdf?src-supplier=Farnell; ComponentLink4Description: https://datasheet.ciiva.com/5750/586796-5750949.pdf?src-supplier=Farnell; ComponentLink5URL: https://datasheet.ciiva.com/10034/eng-ds-1-1773440-6-0506-10034394.pdf?src-supplier=Avnet; ComponentLink5Description: https://datasheet.ciiva.com/10034/eng-ds-1-1773440-6-0506-10034394.pdf?src-supplier=Avnet; ComponentLink6URL: https://datasheet.ciiva.com/30052/eng-ds-1-1773440-6-0506-30052600.pdf?src-supplier=Onlinecomponents.com; ComponentLink6Description: https://datasheet.ciiva.com/30052/eng-ds-1-1773440-6-0506-30052600.pdf?src-supplier=Onlinecomponents.com; ComponentLink7URL: https://datasheet.ciiva.com/669/eng-cd-84953-a3-669167.pdf?src-supplier=Digi-Key; ComponentLink7Description: https://datasheet.ciiva.com/669/eng-cd-84953-a3-669167.pdf?src-supplier=Digi-Key; ComponentLink8URL: https://datasheet.ciiva.com/669/eng-cd-84953-a3-669168.pdf?src-supplier=Digi-Key; ComponentLink8Description: https://datasheet.ciiva.com/669/eng-cd-84953-a3-669168.pdf?src-supplier=Digi-Key; ComponentLink9URL: https://datasheet.ciiva.com/669/eng-cd-84953-a3-669166.pdf?src-supplier=Digi-Key; ComponentLink9Description: https://datasheet.ciiva.com/669/eng-cd-84953-a3-669166.pdf?src-supplier=Digi-Key; Supplier Part Number 1: 571-3-84953-0
U1-U4 = ADG728: Analog Multiplexer Single 8:1 16-Pin TSSOP Tube; Manufacturer: Analog Devices; Manufacturer Part Number: ADG728BRUZ; Min Supply Voltage: 2.7V; Max Supply Voltage: 5.5V; On-State Resistance: 4.5R; Throw Configuration: DPST; Number of Circuits: 1; -3db Bandwidth: 65MHz; Max Power Dissipation: 100uW; Number of Inputs: 8; Max Supply Current: 20uA; Interface: Serial,2-Wire; Operating Supply Current: 10uA; Turn-Off Delay Time: 85ns; Turn-On Delay Time: 95ns; High Level Output Current: 120mA; Drain to Source Resistance: 2.5R; Supplier 1: Mouser; RoHS: Yes; Category: Decoders and Multiplexers; Stock 1: 392; Pricing 1: 1=6.74000, 10=6.06000, 50=5.73000, 100=4.96000, 1000=3.59000, 10000=3.59000 (USD); Case/Package: TSSOP; Number of Pins: 16; Contact Plating: Tin,Matte; Min Operating Temperature: -40°C; Max Operating Temperature: 85°C; Packaging: Rail/Tube; Package Quantity: 96; Series: -; Number of Channels: 1; Number of Outputs: 1; Bandwidth: 65MHz; Number of Bits: 8; Nominal Supply Current: 20uA; Supply Current: 20uA; Length: 5mm; Width: 4.4mm; Height: 1.05mm; Radiation Hardening: No; Lead Free: Contains Lead; RoHS Compliant: Yes; REACH SVHC: No SVHC; ComponentLink1URL: https://datasheet.ciiva.com/1171/1610644-1171108.pdf?src-supplier=Element14; ComponentLink1Description: https://datasheet.ciiva.com/1171/1610644-1171108.pdf?src-supplier=Element14; ComponentLink2URL: https://datasheet.ciiva.com/5797/adg728-729-5797207.pdf?src-supplier=Farnell; ComponentLink2Description: https://datasheet.ciiva.com/5797/adg728-729-5797207.pdf?src-supplier=Farnell; ComponentLink3URL: https://datasheet.ciiva.com/1668/adg728-729-1668904.pdf?src-supplier=Digi-Key; ComponentLink3Description: https://datasheet.ciiva.com/1668/adg728-729-1668904.pdf?src-supplier=Digi-Key; ComponentLink4URL: https://datasheet.ciiva.com/2978/adg728-729-2978667.pdf?src-supplier=Avnet; ComponentLink4Description: https://datasheet.ciiva.com/2978/adg728-729-2978667.pdf?src-supplier=Avnet; ComponentLink5URL: https://datasheet.ciiva.com/7986/adg728-729-7986413.pdf?src-supplier=Element14; ComponentLink5Description: https://datasheet.ciiva.com/7986/adg728-729-7986413.pdf?src-supplier=Element14; ComponentLink6URL: https://datasheet.ciiva.com/48708/001248036-da-01-en-ic-mux-demux-8x1-adg728bruz-tssop-16-adi-48708636.pdf?src-supplier=Conrad; ComponentLink6Description: https://datasheet.ciiva.com/48708/001248036-da-01-en-ic-mux-demux-8x1-adg728bruz-tssop-16-adi-48708636.pdf?src-supplier=Conrad; Supplier Part Number 1: 584-ADG728BRUZ

## Sheet AFE.SchDoc
size A4; SheetNumber: 3; SheetTotal: 6
Used 28 times, as channels Thermistor_ADC/AFE1, Thermistor_ADC/AFE2, Thermistor_ADC/AFE3, Thermistor_ADC/AFE4, Thermistor_ADC/AFE5, Thermistor_ADC/AFE6, Thermistor_ADC/AFE7, Thermistor_ADC/AFE8, Thermistor_ADC/AFE9, Thermistor_ADC/AFE10, Thermistor_ADC/AFE11, Thermistor_ADC/AFE12, Thermistor_ADC/AFE13, Thermistor_ADC/AFE14, Thermistor_ADC/AFE15, Thermistor_ADC/AFE16, Thermistor_ADC/AFE17, Thermistor_ADC/AFE18, Thermistor_ADC/AFE19, Thermistor_ADC/AFE20, Thermistor_ADC/AFE21, Thermistor_ADC/AFE22, Thermistor_ADC/AFE23, Thermistor_ADC/AFE24, Thermistor_ADC/AFE25, Thermistor_ADC/AFE26, Thermistor_ADC/AFE27, Thermistor_ADC/AFE28. Parts and nets are listed once, with the designators drawn on the sheet.
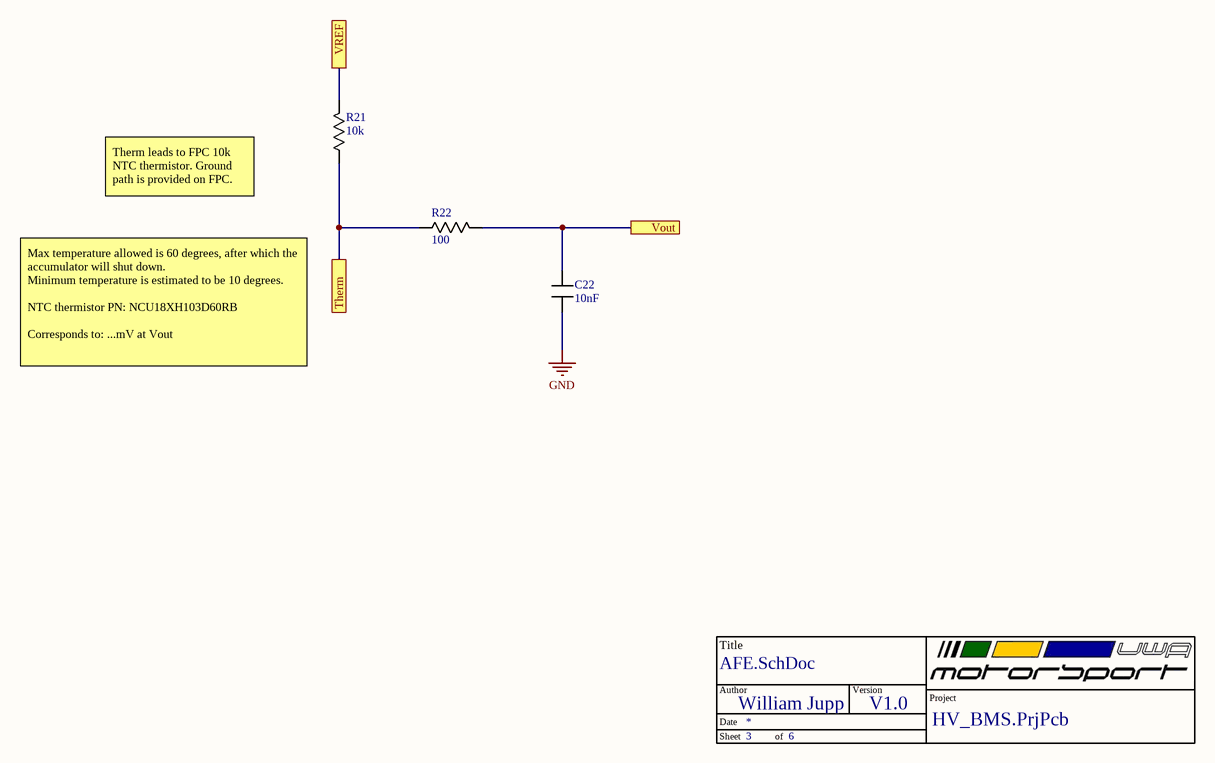
[diagram p5: AFE.SchDoc]

### Parts
*  TitleBlock  (value not drawn)  (graphical)
C22  value 10nF  [C_0603]  (hidden comment: C)
R21  value 10k  [R-0603]  (hidden comment: CRT0603-BY-1002EST)
R22  value 100  [R-0603]  (hidden comment: Resistor)

### Ports
Therm, Vout, VREF

### Nets
GND: C22.1
Therm: R21.1 R22.1 ; port Therm
Vout: C22.2 R22.2 ; port Vout
VREF: R21.2 ; port VREF

### Channels
Thermistor_ADC/AFE1: designators end in _AFE1; ports Therm=FPC1 Vout=ADCIN1 VREF=VREF2
Thermistor_ADC/AFE2: designators end in _AFE2; ports Therm=FPC2 Vout=ADCIN2 VREF=VREF2
Thermistor_ADC/AFE3: designators end in _AFE3; ports Therm=FPC3 Vout=ADCIN3 VREF=VREF2
Thermistor_ADC/AFE4: designators end in _AFE4; ports Therm=FPC4 Vout=ADCIN4 VREF=VREF2
Thermistor_ADC/AFE5: designators end in _AFE5; ports Therm=FPC5 Vout=ADCIN5 VREF=VREF2
Thermistor_ADC/AFE6: designators end in _AFE6; ports Therm=FPC6 Vout=ADCIN6 VREF=VREF2
Thermistor_ADC/AFE7: designators end in _AFE7; ports Therm=FPC7 Vout=ADCIN7 VREF=VREF2
Thermistor_ADC/AFE8: designators end in _AFE8; ports Therm=FPC8 Vout=ADCIN8 VREF=VREF2
Thermistor_ADC/AFE9: designators end in _AFE9; ports Therm=FPC9 Vout=ADCIN9 VREF=VREF2
Thermistor_ADC/AFE10: designators end in _AFE10; ports Therm=FPC10 Vout=ADCIN10 VREF=VREF2
Thermistor_ADC/AFE11: designators end in _AFE11; ports Therm=FPC11 Vout=ADCIN11 VREF=VREF2
Thermistor_ADC/AFE12: designators end in _AFE12; ports Therm=FPC12 Vout=ADCIN12 VREF=VREF2
Thermistor_ADC/AFE13: designators end in _AFE13; ports Therm=FPC13 Vout=ADCIN13 VREF=VREF2
Thermistor_ADC/AFE14: designators end in _AFE14; ports Therm=FPC14 Vout=ADCIN14 VREF=VREF2
Thermistor_ADC/AFE15: designators end in _AFE15; ports Therm=FPC15 Vout=ADCIN15 VREF=VREF2
Thermistor_ADC/AFE16: designators end in _AFE16; ports Therm=FPC16 Vout=ADCIN16 VREF=VREF2
Thermistor_ADC/AFE17: designators end in _AFE17; ports Therm=FPC17 Vout=ADCIN17 VREF=VREF2
Thermistor_ADC/AFE18: designators end in _AFE18; ports Therm=FPC18 Vout=ADCIN18 VREF=VREF2
Thermistor_ADC/AFE19: designators end in _AFE19; ports Therm=FPC19 Vout=ADCIN19 VREF=VREF2
Thermistor_ADC/AFE20: designators end in _AFE20; ports Therm=FPC20 Vout=ADCIN20 VREF=VREF2
Thermistor_ADC/AFE21: designators end in _AFE21; ports Therm=FPC21 Vout=ADCIN21 VREF=VREF2
Thermistor_ADC/AFE22: designators end in _AFE22; ports Therm=FPC22 Vout=ADCIN22 VREF=VREF2
Thermistor_ADC/AFE23: designators end in _AFE23; ports Therm=FPC23 Vout=ADCIN23 VREF=VREF2
Thermistor_ADC/AFE24: designators end in _AFE24; ports Therm=FPC24 Vout=ADCIN24 VREF=VREF2
Thermistor_ADC/AFE25: designators end in _AFE25; ports Therm=FPC25 Vout=ADCIN25 VREF=VREF2
Thermistor_ADC/AFE26: designators end in _AFE26; ports Therm=FPC26 Vout=ADCIN26 VREF=VREF2
Thermistor_ADC/AFE27: designators end in _AFE27; ports Therm=FPC27 Vout=ADCIN27 VREF=VREF2
Thermistor_ADC/AFE28: designators end in _AFE28; ports Therm=FPC28 Vout=ADCIN28 VREF=VREF2

### Notes on the sheet
- Therm leads to FPC 10k NTC thermistor. Ground path is provided on FPC.
- Max temperature allowed is 60 degrees, after which the accumulator will shut down.
  Minimum temperature is estimated to be 10 degrees.
  NTC thermistor PN: NCU18XH103D60RB
  Corresponds to: ...mV at Vout
- (in symbol TitleBlock) Title; Author; Version; Project; Date; Sheet; of

### Library data of the parts
C22 = Capacitor: ComponentLink1Description: New link; ComponentLink1URL: *
R21 = Resistor: Res Thin Film 0603 10K Ohm 0.1% 0.1W(1/10W) ±25ppm/C Pad SMD T/R; Manufacturer: Bourns; Resistance: 10kR; Max Power Dissipation: 100mW; Temperature Coefficient: 25ppm/°C; Supplier 1: Mouser; Supplier Part Number 1: 652-CRT0603BY1002EST; Manufacturer Part Number: CRT0603-BY-1002EST; RoHS: Yes; Category: Chip SMD Resistors; Stock 1: 2315; Pricing 1: 1=0.33000, 10=0.15400, 50=0.15400, 100=0.08500, 1000=0.04700, 10000=0.03600 (USD); Case/Package: 0603; Case Code (Imperial): 0603; Case Code (Metric): 1608; Min Operating Temperature: -55°C; Max Operating Temperature: 155°C; Resistor Type: Thin Film; Packaging: Tape and Reel; Tolerance: 0.1%; Number of Terminations: 2; ComponentLink1URL: https://www.bourns.com/docs/Product-Datasheets/CRT-ST.pdf?src-supplier=Digi-Key; ComponentLink1Description: https://www.bourns.com/docs/Product-Datasheets/CRT-ST.pdf?src-supplier=Digi-Key